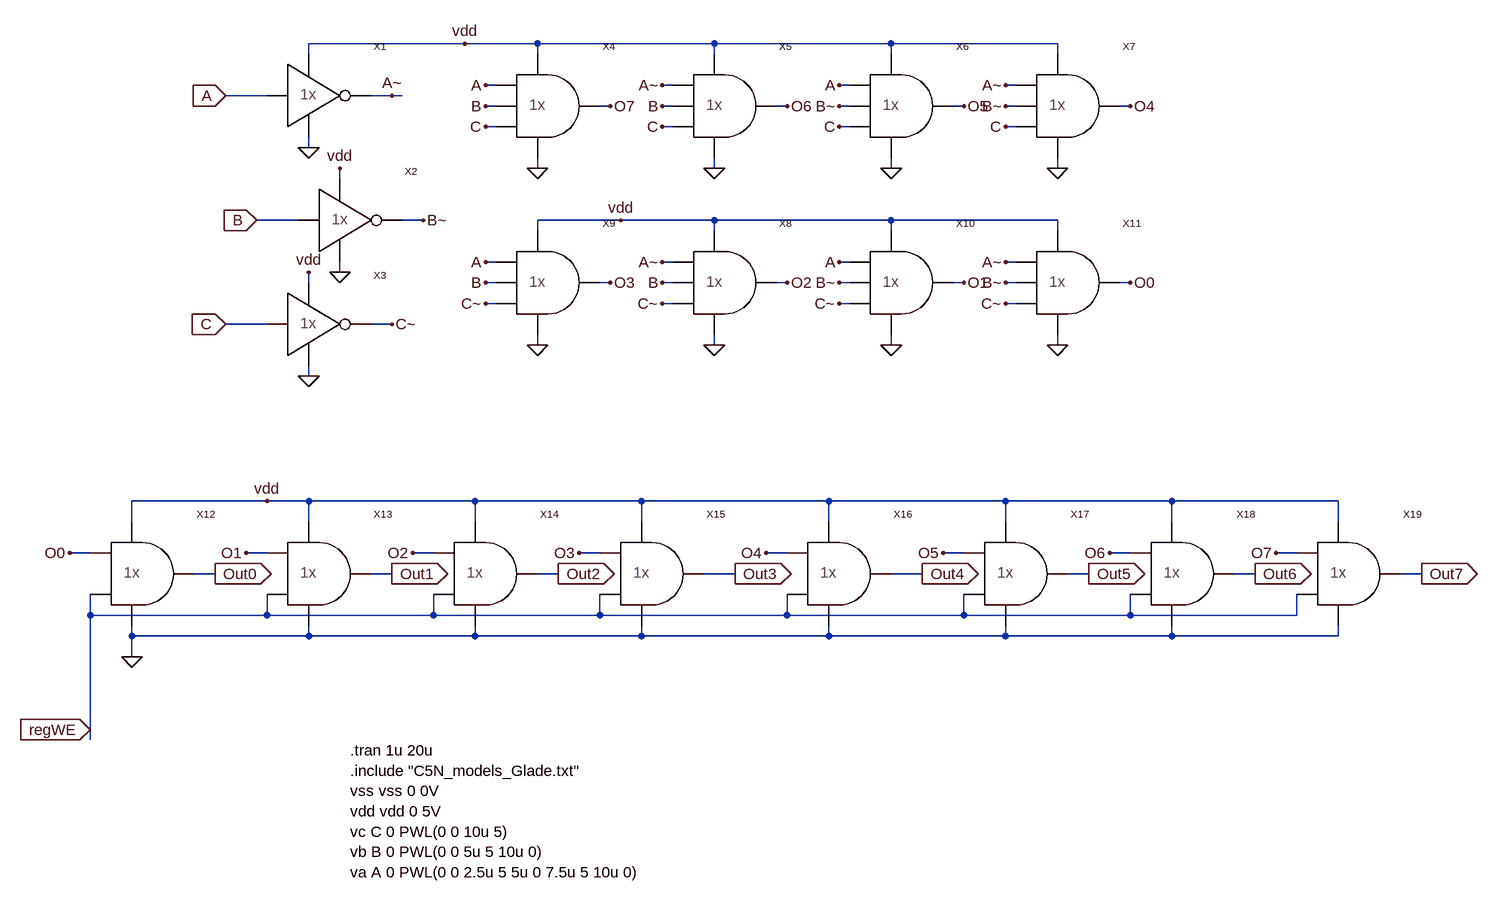
[diagram p0: schematic decoderForFinal.asc]
decoderForFinal.asc, the LTspice schematic file:
Version 4
SHEET 1 3912 1496
WIRE 400 0 160 0
WIRE 512 0 400 0
WIRE 784 0 512 0
WIRE 1056 0 784 0
WIRE 1312 0 1056 0
WIRE 160 16 160 0
WIRE 512 16 512 0
WIRE 784 16 784 0
WIRE 1056 16 1056 0
WIRE 1312 16 1312 0
WIRE 448 64 432 64
WIRE 720 64 704 64
WIRE 992 64 976 64
WIRE 1248 64 1232 64
WIRE 96 80 32 80
WIRE 288 80 256 80
WIRE 304 80 288 80
WIRE 448 96 432 96
WIRE 624 96 608 96
WIRE 720 96 704 96
WIRE 896 96 880 96
WIRE 992 96 976 96
WIRE 1168 96 1152 96
WIRE 1248 96 1232 96
WIRE 1424 96 1408 96
WIRE 448 128 432 128
WIRE 720 128 704 128
WIRE 992 128 976 128
WIRE 1248 128 1232 128
WIRE 160 160 160 144
WIRE 512 192 512 176
WIRE 784 192 784 176
WIRE 1056 192 1056 176
WIRE 1312 192 1312 176
WIRE 208 208 208 192
WIRE 144 272 80 272
WIRE 336 272 304 272
WIRE 640 272 512 272
WIRE 784 272 640 272
WIRE 1056 272 784 272
WIRE 1312 272 1056 272
WIRE 512 288 512 272
WIRE 784 288 784 272
WIRE 1056 288 1056 272
WIRE 1312 288 1312 272
WIRE 448 336 432 336
WIRE 720 336 704 336
WIRE 992 336 976 336
WIRE 1248 336 1232 336
WIRE 208 352 208 336
WIRE 160 368 160 352
WIRE 448 368 432 368
WIRE 624 368 608 368
WIRE 720 368 704 368
WIRE 896 368 880 368
WIRE 992 368 976 368
WIRE 1168 368 1152 368
WIRE 1248 368 1232 368
WIRE 1424 368 1408 368
WIRE 448 400 432 400
WIRE 720 400 704 400
WIRE 992 400 976 400
WIRE 1248 400 1232 400
WIRE 96 432 32 432
WIRE 288 432 256 432
WIRE 512 464 512 448
WIRE 784 464 784 448
WIRE 1056 464 1056 448
WIRE 1312 464 1312 448
WIRE 160 512 160 496
WIRE 96 704 -112 704
WIRE 160 704 96 704
WIRE 416 704 160 704
WIRE 672 704 416 704
WIRE 960 704 672 704
WIRE 1232 704 960 704
WIRE 1488 704 1232 704
WIRE 1744 704 1488 704
WIRE -112 736 -112 704
WIRE 160 736 160 704
WIRE 416 736 416 704
WIRE 672 736 672 704
WIRE 960 736 960 704
WIRE 1232 736 1232 704
WIRE 1488 736 1488 704
WIRE 1744 736 1744 704
WIRE -176 784 -208 784
WIRE 96 784 64 784
WIRE 352 784 320 784
WIRE 608 784 576 784
WIRE 896 784 864 784
WIRE 1168 784 1136 784
WIRE 1424 784 1392 784
WIRE 1680 784 1648 784
WIRE 16 816 -16 816
WIRE 288 816 256 816
WIRE 544 816 512 816
WIRE 816 816 768 816
WIRE 1104 816 1056 816
WIRE 1360 816 1328 816
WIRE 1616 816 1584 816
WIRE 1872 816 1840 816
WIRE -176 880 -176 848
WIRE 96 880 96 848
WIRE 96 880 -176 880
WIRE 352 880 352 848
WIRE 352 880 96 880
WIRE 608 880 608 848
WIRE 608 880 352 880
WIRE 896 880 896 848
WIRE 896 880 608 880
WIRE 1168 880 1168 848
WIRE 1168 880 896 880
WIRE 1424 880 1424 848
WIRE 1424 880 1168 880
WIRE 1680 880 1680 848
WIRE 1680 880 1424 880
WIRE -112 912 -112 896
WIRE 160 912 160 896
WIRE 160 912 -112 912
WIRE 416 912 416 896
WIRE 416 912 160 912
WIRE 672 912 672 896
WIRE 672 912 416 912
WIRE 960 912 960 896
WIRE 960 912 672 912
WIRE 1232 912 1232 896
WIRE 1232 912 960 912
WIRE 1488 912 1488 896
WIRE 1488 912 1232 912
WIRE 1744 912 1744 896
WIRE 1744 912 1488 912
WIRE -112 944 -112 912
WIRE -176 1056 -176 880
WIRE -176 1072 -176 1056
FLAG 32 80 A
IOPIN 32 80 In
FLAG 80 272 B
IOPIN 80 272 In
FLAG 32 432 C
IOPIN 32 432 In
FLAG 400 0 vdd
FLAG 208 192 vdd
FLAG 160 160 0
FLAG 160 352 vdd
FLAG 208 352 0
FLAG 160 512 0
FLAG 288 80 A~
FLAG 336 272 B~
FLAG 288 432 C~
FLAG 512 192 0
FLAG 784 192 0
FLAG 1056 192 0
FLAG 1312 192 0
FLAG 624 96 O7
FLAG 896 96 O6
FLAG 1168 96 O5
FLAG 1424 96 O4
FLAG 1424 368 O0
FLAG 1168 368 O1
FLAG 896 368 O2
FLAG 624 368 O3
FLAG 1056 464 0
FLAG 1312 464 0
FLAG 784 464 0
FLAG 512 464 0
FLAG 640 272 vdd
FLAG 432 64 A
FLAG 432 96 B
FLAG 432 128 C
FLAG 704 64 A~
FLAG 704 96 B
FLAG 704 128 C
FLAG 432 336 A
FLAG 432 368 B
FLAG 432 400 C~
FLAG 704 336 A~
FLAG 704 368 B
FLAG 704 400 C~
FLAG 976 336 A
FLAG 976 368 B~
FLAG 976 400 C~
FLAG 976 128 C
FLAG 976 96 B~
FLAG 976 64 A
FLAG 1232 64 A~
FLAG 1232 96 B~
FLAG 1232 128 C
FLAG 1232 336 A~
FLAG 1232 368 B~
FLAG 1232 400 C~
FLAG 96 704 vdd
FLAG -112 944 0
FLAG -176 1056 regWE
IOPIN -176 1056 In
FLAG 16 816 Out0
IOPIN 16 816 Out
FLAG 288 816 Out1
IOPIN 288 816 Out
FLAG 544 816 Out2
IOPIN 544 816 Out
FLAG 816 816 Out3
IOPIN 816 816 Out
FLAG 1104 816 Out4
IOPIN 1104 816 Out
FLAG 1360 816 Out5
IOPIN 1360 816 Out
FLAG 1616 816 Out6
IOPIN 1616 816 Out
FLAG 1872 816 Out7
IOPIN 1872 816 Out
FLAG -208 784 O0
FLAG 64 784 O1
FLAG 320 784 O2
FLAG 576 784 O3
FLAG 864 784 O4
FLAG 1136 784 O5
FLAG 1392 784 O6
FLAG 1648 784 O7
SYMBOL inv_1x 160 80 R0
SYMATTR InstName X1
SYMBOL inv_1x 208 272 R0
SYMATTR InstName X2
SYMBOL inv_1x 160 432 R0
SYMATTR InstName X3
SYMBOL and3_1x 512 96 R0
SYMATTR InstName X4
SYMBOL and3_1x 784 96 R0
SYMATTR InstName X5
SYMBOL and3_1x 1056 96 R0
SYMATTR InstName X6
SYMBOL and3_1x 1312 96 R0
SYMATTR InstName X7
SYMBOL and3_1x 784 368 R0
SYMATTR InstName X8
SYMBOL and3_1x 512 368 R0
SYMATTR InstName X9
SYMBOL and3_1x 1056 368 R0
SYMATTR InstName X10
SYMBOL and3_1x 1312 368 R0
SYMATTR InstName X11
SYMBOL and2_1x -112 816 R0
SYMATTR InstName X12
SYMBOL and2_1x 160 816 R0
SYMATTR InstName X13
SYMBOL and2_1x 416 816 R0
SYMATTR InstName X14
SYMBOL and2_1x 672 816 R0
SYMATTR InstName X15
SYMBOL and2_1x 960 816 R0
SYMATTR InstName X16
SYMBOL and2_1x 1232 816 R0
SYMATTR InstName X17
SYMBOL and2_1x 1488 816 R0
SYMATTR InstName X18
SYMBOL and2_1x 1744 816 R0
SYMATTR InstName X19
TEXT 224 1088 Left 2 !.tran 1u 20u\n.include "C5N_models_Glade.txt"\nvss vss 0 0V\nvdd vdd 0 5V\nvc C 0 PWL(0 0 10u 5)\nvb B 0 PWL(0 0 5u 5 10u 0)\nva A 0 PWL(0 0 2.5u 5 5u 0 7.5u 5 10u 0)

The netlist it stands for:
* decoderForFinal.asc
XX1 A A~ vdd 0 inv_1x  ; pins A Z vdd vss
XX2 B B~ vdd 0 inv_1x  ; pins A Z vdd vss
XX3 C C~ vdd 0 inv_1x  ; pins A Z vdd vss
XX4 A B C O7 vdd 0 and3_1x  ; pins A B C Y vdd vss
XX5 A~ B C O6 vdd 0 and3_1x  ; pins A B C Y vdd vss
XX6 A B~ C O5 vdd 0 and3_1x  ; pins A B C Y vdd vss
XX7 A~ B~ C O4 vdd 0 and3_1x  ; pins A B C Y vdd vss
XX8 A~ B C~ O2 vdd 0 and3_1x  ; pins A B C Y vdd vss
XX9 A B C~ O3 vdd 0 and3_1x  ; pins A B C Y vdd vss
XX10 A B~ C~ O1 vdd 0 and3_1x  ; pins A B C Y vdd vss
XX11 A~ B~ C~ O0 vdd 0 and3_1x  ; pins A B C Y vdd vss
XX12 O0 regWE Out0 vdd 0 and2_1x  ; pins A B Y vdd vss
XX13 O1 regWE Out1 vdd 0 and2_1x  ; pins A B Y vdd vss
XX14 O2 regWE Out2 vdd 0 and2_1x  ; pins A B Y vdd vss
XX15 O3 regWE Out3 vdd 0 and2_1x  ; pins A B Y vdd vss
XX16 O4 regWE Out4 vdd 0 and2_1x  ; pins A B Y vdd vss
XX17 O5 regWE Out5 vdd 0 and2_1x  ; pins A B Y vdd vss
XX18 O6 regWE Out6 vdd 0 and2_1x  ; pins A B Y vdd vss
XX19 O7 regWE Out7 vdd 0 and2_1x  ; pins A B Y vdd vss
.tran 1u 20u
.include "C5N_models_Glade.txt"
vss vss 0 0V
vdd vdd 0 5V
vc C 0 PWL(0 0 10u 5)
vb B 0 PWL(0 0 5u 5 10u 0)
va A 0 PWL(0 0 2.5u 5 5u 0 7.5u 5 10u 0)
.backanno
.end